# EAGLE design Register (EAGLE 9.6.2)
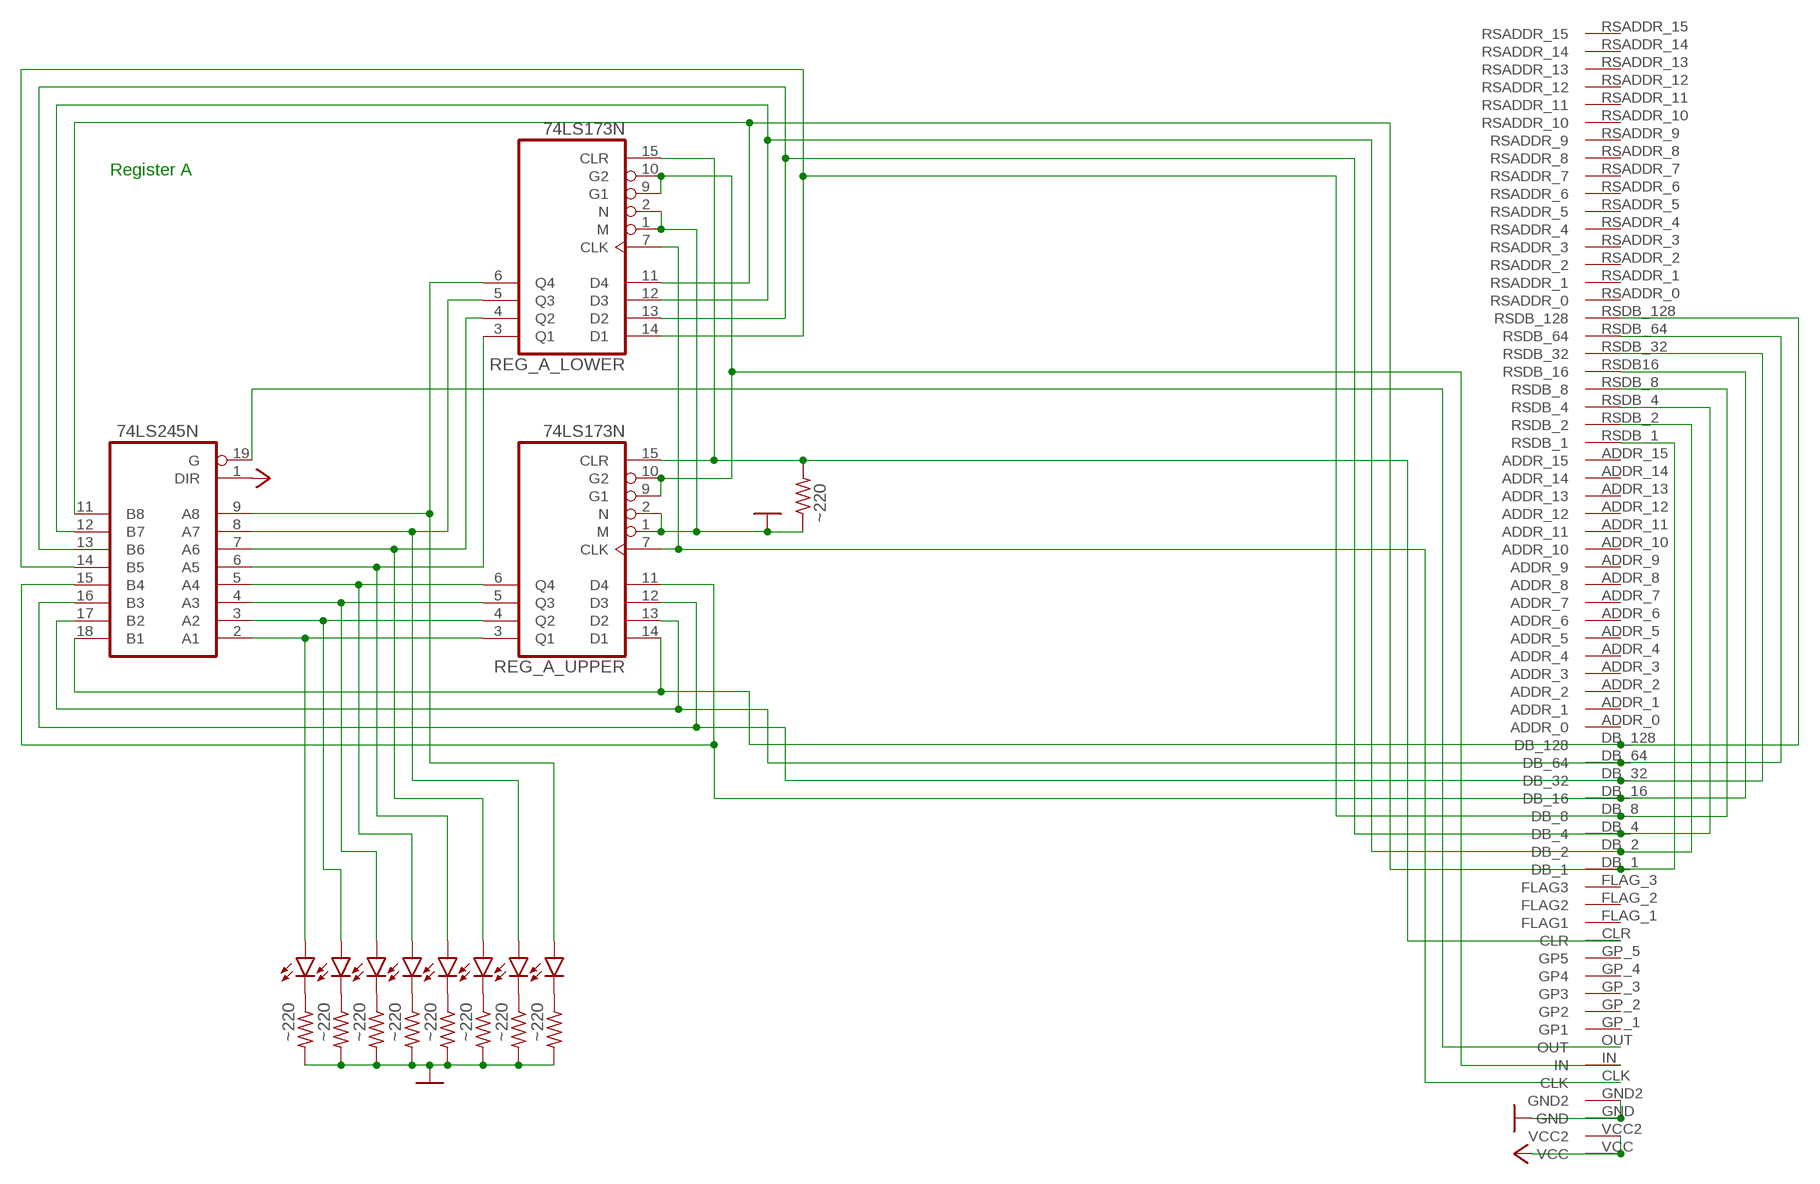
[diagram p0: schematic, sheet 1]

## Parts
LED_A_REG_1  LED  LED5MM  [LED5MM]
LED_A_REG_2  LED  LED5MM  [LED5MM]
LED_A_REG_3  LED  LED5MM  [LED5MM]
LED_A_REG_4  LED  LED5MM  [LED5MM]
LED_A_REG_5  LED  LED5MM  [LED5MM]
LED_A_REG_6  LED  LED5MM  [LED5MM]
LED_A_REG_7  LED  LED5MM  [LED5MM]
LED_A_REG_8  LED  LED5MM  [LED5MM]
OUTPUT_BUFFER_REG_A  74LS245N  [DIL20]
R1  ~220  R-US_0204/7  [0204/7]
R2  ~220  R-US_0204/7  [0204/7]
R3  ~220  R-US_0204/7  [0204/7]
R4  ~220  R-US_0204/7  [0204/7]
R5  ~220  R-US_0204/7  [0204/7]
R6  ~220  R-US_0204/7  [0204/7]
R7  ~220  R-US_0204/7  [0204/7]
R8  ~220  R-US_0204/7  [0204/7]
R9  ~220  R-US_0204/7  [0204/7]
REG_A_LOWER  74LS173N  [DIL16]
REG_A_UPPER  74LS173N  [DIL16]
U$1  BACKPLATE_INTERFACE  [EDGE_FOOTPRINT]

## Nets
1_PLACE1 [Databus]: OUTPUT_BUFFER_REG_A.11(B8) REG_A_LOWER.11(D4) U$1.DB_1 U$1.RSDB_1
2_PLACE [Databus]: OUTPUT_BUFFER_REG_A.12(B7) REG_A_LOWER.12(D3) U$1.DB_2 U$1.RSDB_2
4_PLACE [Databus]: OUTPUT_BUFFER_REG_A.13(B6) REG_A_LOWER.13(D2) U$1.DB_4 U$1.RSDB_4
8_PLACE [Databus]: OUTPUT_BUFFER_REG_A.14(B5) REG_A_LOWER.14(D1) U$1.DB_8 U$1.RSDB_8
16_PLACE [Databus]: OUTPUT_BUFFER_REG_A.15(B4) REG_A_UPPER.11(D4) U$1.DB_16 U$1.RSDB16(RSDB_16)
32_PLACE [Databus]: OUTPUT_BUFFER_REG_A.16(B3) REG_A_UPPER.12(D3) U$1.DB_32 U$1.RSDB_32
64_PLACE [Databus]: OUTPUT_BUFFER_REG_A.17(B2) REG_A_UPPER.13(D2) U$1.DB_64 U$1.RSDB_64
128_PLACE [Databus]: OUTPUT_BUFFER_REG_A.18(B1) REG_A_UPPER.14(D1) U$1.DB_128 U$1.RSDB_128
CLOCK: REG_A_LOWER.7(CLK) REG_A_UPPER.7(CLK) U$1.CLK
CLR_REG: R9.2 REG_A_LOWER.15(CLR) REG_A_UPPER.15(CLR) U$1.CLR
GND: R1.2 R2.2 R3.2 R4.2 R5.2 R6.2 R7.2 R8.2 R9.1 REG_A_LOWER.1(M) REG_A_LOWER.2(N) REG_A_UPPER.1(M) REG_A_UPPER.2(N) U$1.GND U$1.GND2
N$2: LED_A_REG_1.K(C) R1.1
N$120: LED_A_REG_2.K(C) R2.1
N$121: LED_A_REG_3.K(C) R3.1
N$122: LED_A_REG_4.K(C) R4.1
N$123: LED_A_REG_5.K(C) R5.1
N$124: LED_A_REG_6.K(C) R6.1
N$169: LED_A_REG_7.K(C) R7.1
N$176: LED_A_REG_8.K(C) R8.1
REG_A_1PLACE: LED_A_REG_1.A OUTPUT_BUFFER_REG_A.9(A8) REG_A_LOWER.6(Q4)
REG_A_2PLACE: LED_A_REG_2.A OUTPUT_BUFFER_REG_A.8(A7) REG_A_LOWER.5(Q3)
REG_A_4PLACE: LED_A_REG_3.A OUTPUT_BUFFER_REG_A.7(A6) REG_A_LOWER.4(Q2)
REG_A_8PLACE: LED_A_REG_4.A OUTPUT_BUFFER_REG_A.6(A5) REG_A_LOWER.3(Q1)
REG_A_16PLACE: LED_A_REG_5.A OUTPUT_BUFFER_REG_A.5(A4) REG_A_UPPER.6(Q4)
REG_A_32PLACE: LED_A_REG_6.A OUTPUT_BUFFER_REG_A.4(A3) REG_A_UPPER.5(Q3)
REG_A_64PLACE: LED_A_REG_7.A OUTPUT_BUFFER_REG_A.3(A2) REG_A_UPPER.4(Q2)
REG_A_128PLACE: LED_A_REG_8.A OUTPUT_BUFFER_REG_A.2(A1) REG_A_UPPER.3(Q1)
REG_A_IN: REG_A_LOWER.9(G1) REG_A_LOWER.10(G2) REG_A_UPPER.9(G1) REG_A_UPPER.10(G2) U$1.IN
REG_A_OUT: OUTPUT_BUFFER_REG_A.19(G) U$1.OUT
VCC: OUTPUT_BUFFER_REG_A.1(DIR) U$1.VCC U$1.VCC2
Unconnected: U$1.ADDR_0 U$1.ADDR_1 U$1.ADDR_2 U$1.ADDR_3 U$1.ADDR_4 U$1.ADDR_5 U$1.ADDR_6 U$1.ADDR_7 U$1.ADDR_8 U$1.ADDR_9 U$1.ADDR_10 U$1.ADDR_11 U$1.ADDR_12 U$1.ADDR_13 U$1.ADDR_14 U$1.ADDR_15 U$1.FLAG_1(FLAG1) U$1.FLAG_2(FLAG2) U$1.FLAG_3(FLAG3) U$1.GP_1(GP1) U$1.GP_2(GP2) U$1.GP_3(GP3) U$1.GP_4(GP4) U$1.GP_5(GP5) U$1.RSADDR_0 U$1.RSADDR_1 U$1.RSADDR_2 U$1.RSADDR_3 U$1.RSADDR_4 U$1.RSADDR_5 U$1.RSADDR_6 U$1.RSADDR_7 U$1.RSADDR_8 U$1.RSADDR_9 U$1.RSADDR_10 U$1.RSADDR_11 U$1.RSADDR_12 U$1.RSADDR_13 U$1.RSADDR_14 U$1.RSADDR_15

## Notes on the sheet
- Register A

## Power pins joined to a net without a drawn wire
GND: OUTPUT_BUFFER_REG_A.10(GND) REG_A_LOWER.8(GND) REG_A_UPPER.8(GND)
VCC: OUTPUT_BUFFER_REG_A.20(VCC) REG_A_LOWER.16(VCC) REG_A_UPPER.16(VCC)

## Library data of the parts
LED_A_REG_1-LED_A_REG_8 = led:LED: LED OSRAM: - CHIPLED LG R971, LG N971, LY N971, LG Q971, LY Q971, LO R971, LY R971 LH N974, LH R974 LS Q976, LO Q976, LY Q976 LO Q996 - Hyper CHIPLED LW Q18S LB Q993, LB Q99A, LB R99A - SideLED LS A670, LO A670, LY A670, LG A670, LP A670 LB A673, LV A673, LT A673, LW A673 LH A674 LY A675 LS A676, LA A676, LO A676, LY A676, LW A676 LS A679, LY A679, LG A679 - Hyper Micro SIDELED® LS Y876, LA Y876, LO Y876, LY Y876 LT Y87S - SmartLED LW L88C, LW L88S LB L89C, LB L89S, LG L890 LS L89K, LO L89K, LY L89K LS L896, LA L896, LO L896, LY L896 - TOPLED LS T670, LO T670, LY T670, LG T670, LP T670 LSG T670, LSP T670, LSY T670, LOP T670, LYG T670 LG T671, LOG T671, LSG T671 LB T673, LV T673, LT T673, LW T673 LH T674 LS T676, LA T676, LO T676, LY T676, LB T676, LH T676, LSB T676, LW T676 LB T67C, LV T67C, LT T67C, LS T67K, LO T67K, LY T67K, LW E67C LS E67B, LA E67B, LO E67B, LY E67B, LB E67C, LV E67C, LT E67C LW T67C LS T679, LY T679, LG T679 LS T770, LO T770, LY T770, LG T770, LP T770 LB T773, LV T773, LT T773, LW T773 LH T774 LS E675, LA E675, LY E675, LS T675 LS T776, LA T776, LO T776, LY T776, LB T776 LHGB T686 LT T68C, LB T68C - Hyper Mini TOPLED® LB M676 - Mini TOPLED Santana® LG M470 LS M47K, LO M47K, LY M47K Source: http://www.osram.convergy.de LUXEON: - LUMILED® LXK2-PW12-R00, LXK2-PW12-S00, LXK2-PW14-U00, LXK2-PW14-V00 LXK2-PM12-R00, LXK2-PM12-S00, LXK2-PM14-U00 LXK2-PE12-Q00, LXK2-PE12-R00, LXK2-PE12-S00, LXK2-PE14-T00, LXK2-PE14-U00 LXK2-PB12-K00, LXK2-PB12-L00, LXK2-PB12-M00, LXK2-PB14-N00, LXK2-PB14-P00, LXK2-PB14-Q00 LXK2-PR12-L00, LXK2-PR12-M00, LXK2-PR14-Q00, LXK2-PR14-R00 LXK2-PD12-Q00, LXK2-PD12-R00, LXK2-PD12-S00 LXK2-PH12-R00, LXK2-PH12-S00 LXK2-PL12-P00, LXK2-PL12-Q00, LXK2-PL12-R00 Source: www.luxeon.com KINGBRIGHT: KA-3528ASYC Source: www.kingbright.com
OUTPUT_BUFFER_REG_A = 74xx-eu:74*245: Octal BUS TRANSCEIVER, 3-state
R1-R9 = rcl:R-US_: RESISTOR, American symbol; SPICEPREFIX: R
REG_A_LOWER REG_A_UPPER = 74xx-eu:74*173: 4-bit D type REGISTER, 3-state
U$1 = Computer:BACKPLATE_INTERFACE

## Board
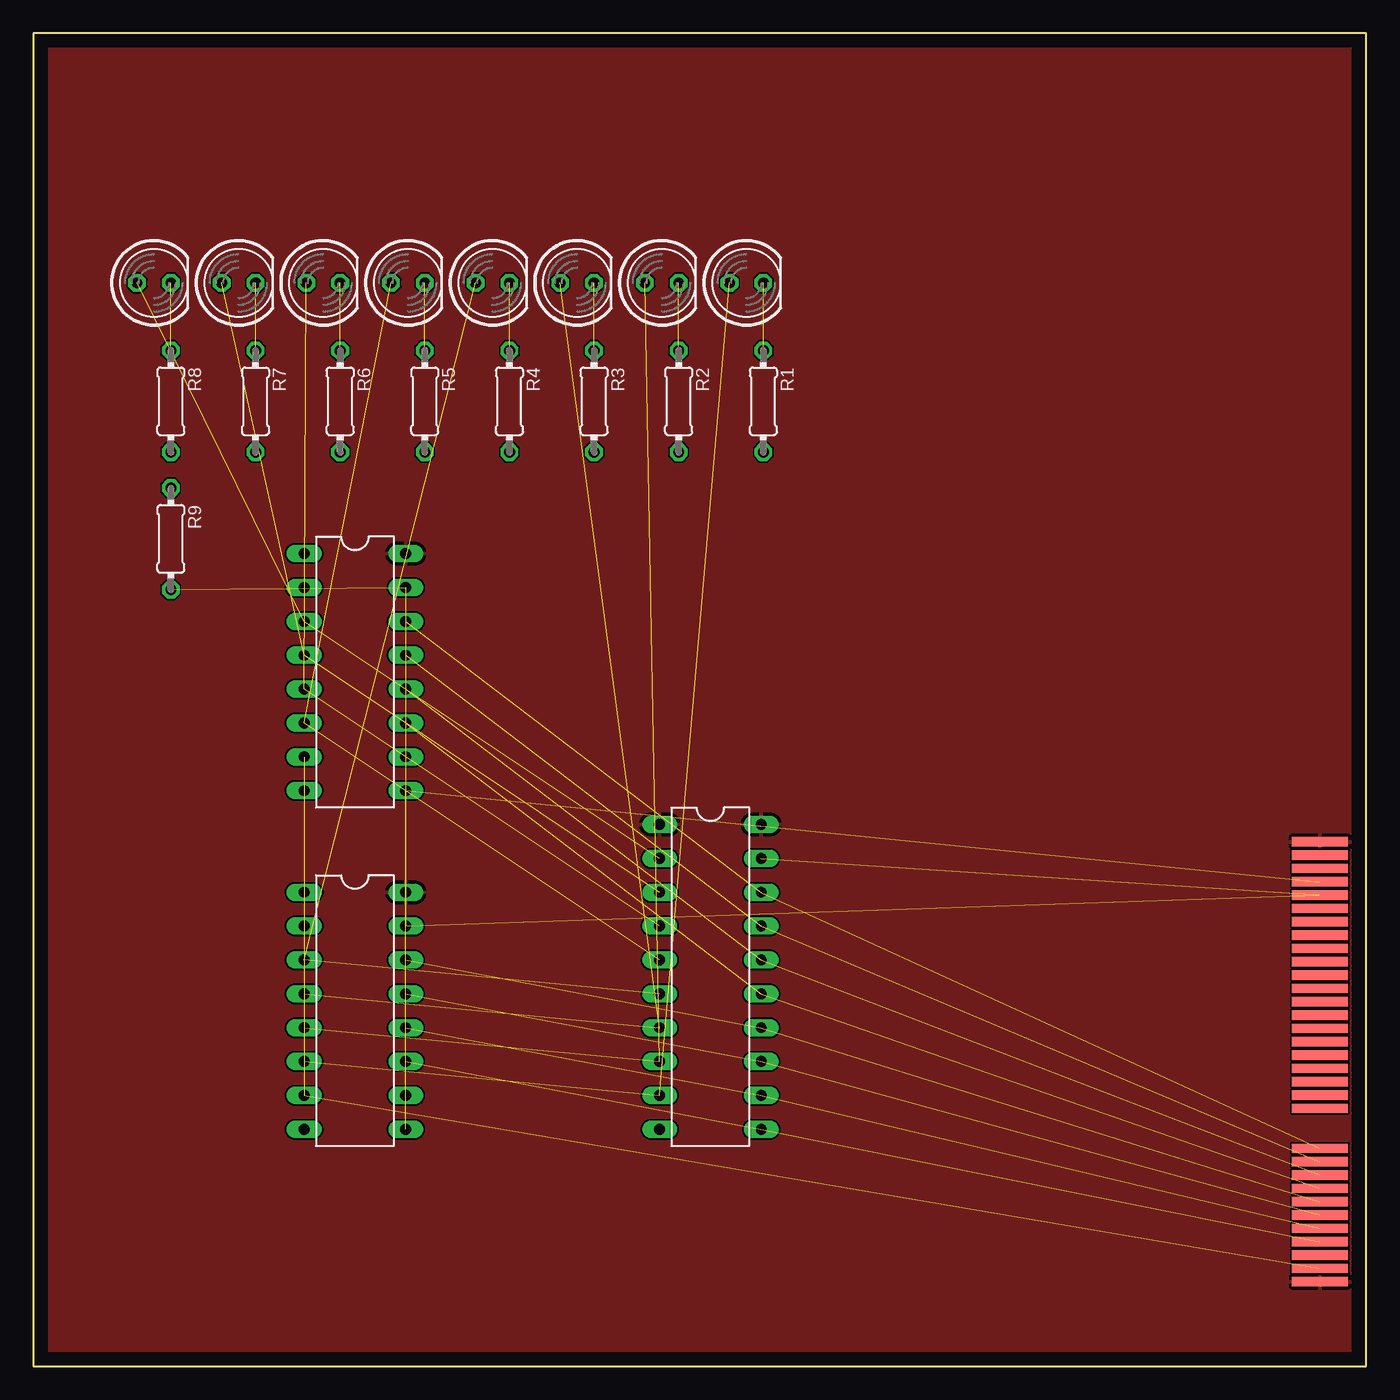
[diagram p1: board, top side]
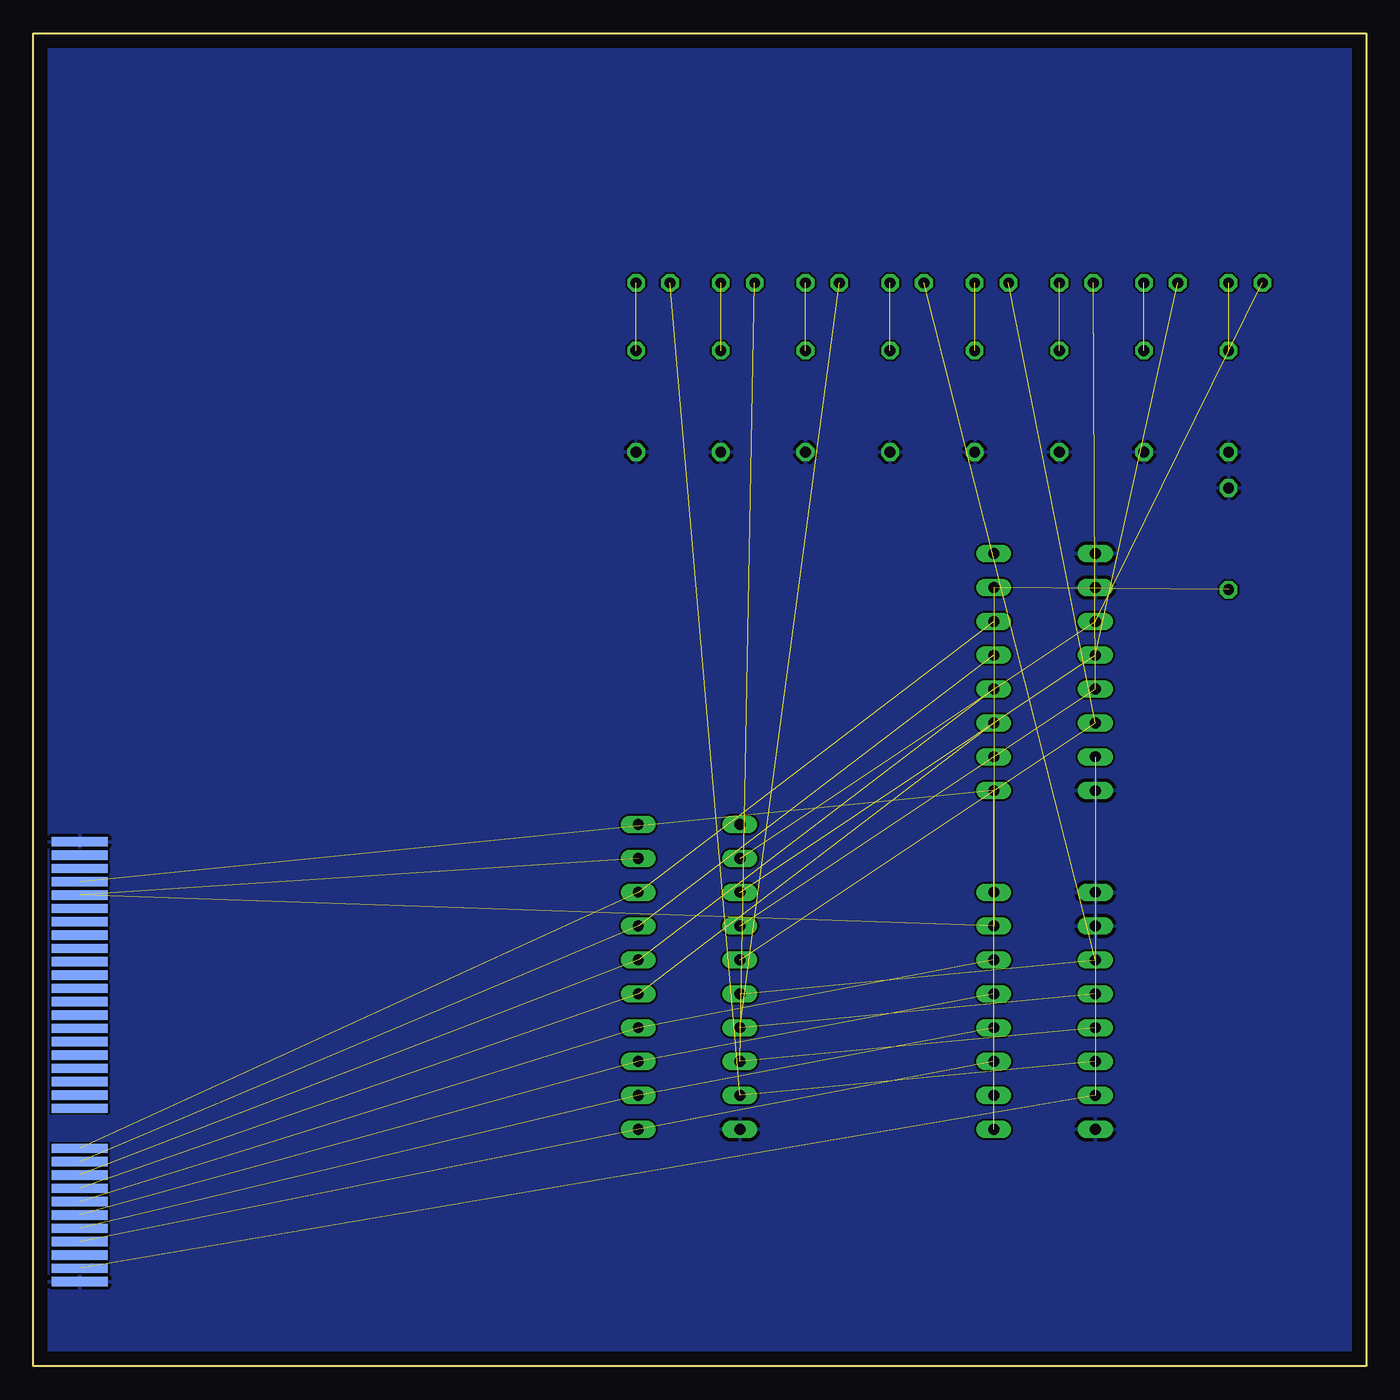
[diagram p2: board, bottom side, seen from below]

Size 100 x 100 mm. Coordinates in mm from the lower left corner, seen from the top.
Outline: 0,0 100,0 100,100 0,100 0,0
Copper layers (1*16): Top 0.035mm / dielectric 1.5mm / Bottom 0.035mm
Design rules "default": minimum track width 6mil, minimum drill 0.35mm, track to track 6mil, track to pad 6mil, pad to pad 6mil, via to via 6mil, smd to smd 6mil, copper to edge 40mil, drill to drill 6mil, minimum pad ring 10mil, minimum via ring 8mil, stop-mask expansion 4mil, vias tented up to drill 0mil, thermal gap 10mil

### Footprints (pad centres in the part's own frame; a part is rotated, then mirrored left to right if it is on the bottom)
LED5MM = drill 0.813 octagon: A -1.27,0; K 1.27,0
DIL20 = drill 0.813 long: 1 -11.43,-3.81; 2 -8.89,-3.81; 3 -6.35,-3.81; 4 -3.81,-3.81; 5 -1.27,-3.81; 6 1.27,-3.81; 7 3.81,-3.81; 8 6.35,-3.81; 9 8.89,-3.81; 10 11.43,-3.81; 11 11.43,3.81; 12 8.89,3.81; 13 6.35,3.81; 14 3.81,3.81; 15 1.27,3.81; 16 -1.27,3.81; 17 -3.81,3.81; 18 -6.35,3.81; 19 -8.89,3.81; 20 -11.43,3.81
0204/7 = drill 0.813 octagon: 1 -3.81,0; 2 3.81,0
DIL16 = drill 0.813 long: 1 -8.89,-3.81; 2 -6.35,-3.81; 3 -3.81,-3.81; 4 -1.27,-3.81; 5 1.27,-3.81; 6 3.81,-3.81; 7 6.35,-3.81; 8 8.89,-3.81; 9 8.89,3.81; 10 6.35,3.81; 11 3.81,3.81; 12 1.27,3.81; 13 -1.27,3.81; 14 -3.81,3.81; 15 -6.35,3.81; 16 -8.89,3.81
EDGE_FOOTPRINT = smd 0.7 x 4.2: ADDR_0 13,0; ADDR_1 14,0; ADDR_2 15,0; ADDR_3 16,0; ADDR_4 17,0; ADDR_5 18,0; ADDR_6 19,0; ADDR_7 20,0; ADDR_8 21,0; ADDR_9 22,0; ADDR_10 23,0; ADDR_11 24,0; ADDR_12 25,0; ADDR_13 26,0; ADDR_14 27,0; ADDR_15 28,0; CLR 29,0; DB_1 3,0; DB_2 4,0; DB_4 5,0; DB_8 6,0; DB_16 7,0; DB_32 8,0; DB_64 9,0; DB_128 10,0; FLAG_1 2,0; FLAG_2 1,0; GP_1 32,0; GP_2 31,0; GP_3 30,0; VCC 0,0; VCC2 33,0 | smd 0.7 x 4.2 bottom: CLK 1,0; FLAG_3 2,0; GND 0,0; GND2 33,0; GP_4 32,0; GP_5 31,0; IN 30,0; OUT 29,0; RSADDR_0 13,0; RSADDR_1 14,0; RSADDR_2 15,0; RSADDR_3 16,0; RSADDR_4 17,0; RSADDR_5 18,0; RSADDR_6 19,0; RSADDR_7 20,0; RSADDR_8 21,0; RSADDR_9 22,0; RSADDR_10 23,0; RSADDR_11 24,0; RSADDR_12 25,0; RSADDR_13 26,0; RSADDR_14 27,0; RSADDR_15 28,0; RSDB16 7,0; RSDB_1 3,0; RSDB_2 4,0; RSDB_4 5,0; RSDB_8 6,0; RSDB_32 8,0; RSDB_64 9,0; RSDB_128 10,0

### Placement (x,y rotation side)
LED_A_REG_1  53.5,81.28 0 top
LED_A_REG_2  47.15,81.28 0 top
LED_A_REG_3  40.8,81.28 0 top
LED_A_REG_4  34.45,81.28 0 top
LED_A_REG_5  28.1,81.28 0 top
LED_A_REG_6  21.75,81.28 0 top
LED_A_REG_7  15.4,81.28 0 top
LED_A_REG_8  9.05,81.28 0 top
OUTPUT_BUFFER_REG_A  50.8,29.21 270 top
R1  54.77,72.39 270 top
R2  48.42,72.39 270 top
R3  42.07,72.39 270 top
R4  35.72,72.39 270 top
R5  29.37,72.39 270 top
R6  23.02,72.39 270 top
R7  16.67,72.39 270 top
R8  10.32,72.39 270 top
R9  10.32,62.07 270 top
REG_A_LOWER  24.13,26.67 270 top
REG_A_UPPER  24.13,52.07 270 top
U$1  96.52,6.35 90 top

### Tracks (layer width: path | path; a pad name or v marks a point on that pad's centre or on a via)
1_PLACE1  (3 unrouted)
2_PLACE  (3 unrouted)
4_PLACE  (3 unrouted)
8_PLACE  (3 unrouted)
16_PLACE  (3 unrouted)
32_PLACE  (3 unrouted)
64_PLACE  (3 unrouted)
128_PLACE  (3 unrouted)
CLOCK  (2 unrouted)
CLR_REG  (3 unrouted)
GND
  pour Bottom: 0,100 100,100 100,0 0,0
N$2  (1 unrouted)
N$120  (1 unrouted)
N$121  (1 unrouted)
N$122  (1 unrouted)
N$123  (1 unrouted)
N$124  (1 unrouted)
N$169  (1 unrouted)
N$176  (1 unrouted)
REG_A_1PLACE  (2 unrouted)
REG_A_2PLACE  (2 unrouted)
REG_A_4PLACE  (2 unrouted)
REG_A_8PLACE  (2 unrouted)
REG_A_16PLACE  (2 unrouted)
REG_A_32PLACE  (2 unrouted)
REG_A_64PLACE  (2 unrouted)
REG_A_128PLACE  (2 unrouted)
REG_A_IN  (4 unrouted)
REG_A_OUT  (1 unrouted)
VCC
  pour Top: 0,100 100,100 100,0 0,0